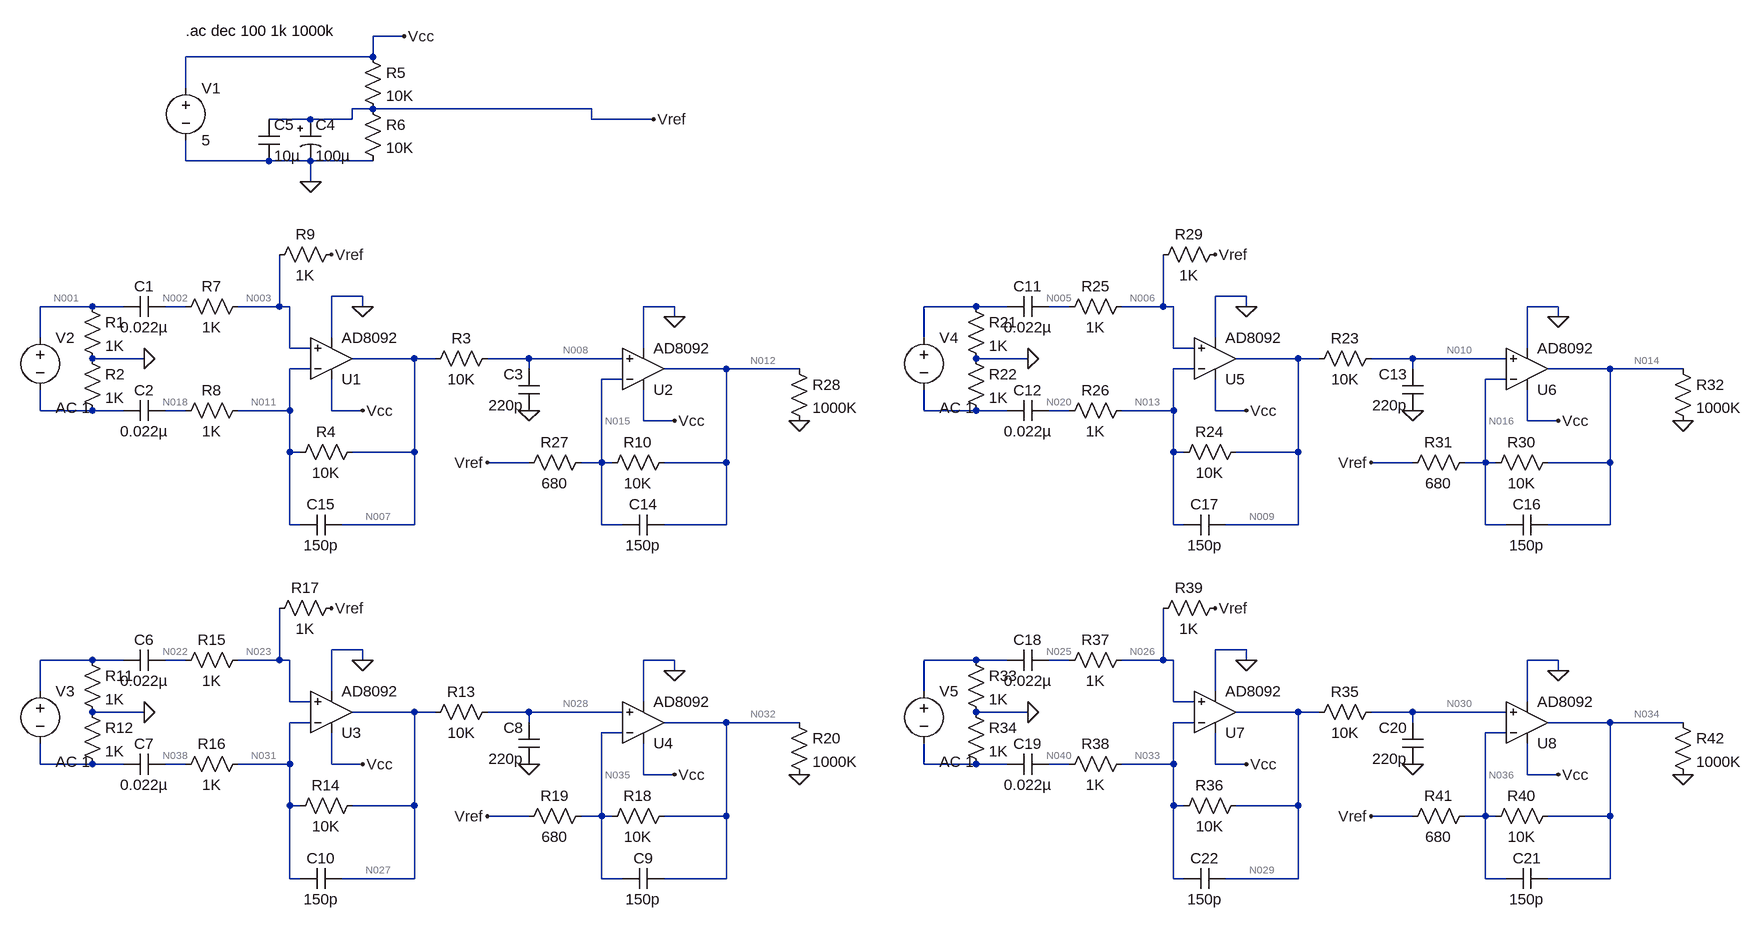
[diagram p0: schematic FilterGain.asc]
FilterGain.asc, the LTspice schematic file:
Version 4
SHEET 1 2400 928
WIRE 144 -432 96 -432
WIRE 96 -400 96 -432
WIRE 96 -400 -192 -400
WIRE -192 -352 -192 -400
WIRE 96 -320 64 -320
WIRE 432 -320 96 -320
WIRE 0 -304 -64 -304
WIRE 64 -304 64 -320
WIRE 64 -304 0 -304
WIRE 432 -304 432 -320
WIRE 528 -304 432 -304
WIRE -192 -240 -192 -272
WIRE -64 -240 -192 -240
WIRE 0 -240 -64 -240
WIRE 96 -240 0 -240
WIRE 0 -208 0 -240
WIRE 80 -32 32 -32
WIRE 1440 -32 1392 -32
WIRE -336 -16 -416 -16
WIRE -288 -16 -336 -16
WIRE -192 -16 -224 -16
WIRE -48 -16 -48 -96
WIRE -48 -16 -112 -16
WIRE -32 -16 -48 -16
WIRE 80 -16 80 -32
WIRE 560 -16 512 -16
WIRE 1024 -16 944 -16
WIRE 1072 -16 1024 -16
WIRE 1168 -16 1136 -16
WIRE 1312 -16 1312 -96
WIRE 1312 -16 1248 -16
WIRE 1328 -16 1312 -16
WIRE 1440 -16 1440 -32
WIRE 1920 -16 1872 -16
WIRE 560 0 560 -16
WIRE 1920 0 1920 -16
WIRE -416 32 -416 -16
WIRE 32 32 32 -32
WIRE 944 32 944 -16
WIRE 1392 32 1392 -32
WIRE -32 48 -32 -16
WIRE 0 48 -32 48
WIRE 512 48 512 -16
WIRE 1328 48 1328 -16
WIRE 1360 48 1328 48
WIRE 1872 48 1872 -16
WIRE -256 64 -336 64
WIRE 160 64 64 64
WIRE 192 64 160 64
WIRE 336 64 272 64
WIRE 480 64 336 64
WIRE 1104 64 1024 64
WIRE 1520 64 1424 64
WIRE 1552 64 1520 64
WIRE 1696 64 1632 64
WIRE 1840 64 1696 64
WIRE 0 80 -32 80
WIRE 336 80 336 64
WIRE 640 80 544 80
WIRE 752 80 640 80
WIRE 1360 80 1328 80
WIRE 1696 80 1696 64
WIRE 2000 80 1904 80
WIRE 2112 80 2000 80
WIRE 480 96 448 96
WIRE 1840 96 1808 96
WIRE -416 144 -416 112
WIRE -336 144 -416 144
WIRE -288 144 -336 144
WIRE -192 144 -224 144
WIRE -32 144 -32 80
WIRE -32 144 -112 144
WIRE 32 144 32 96
WIRE 80 144 32 144
WIRE 944 144 944 112
WIRE 1024 144 944 144
WIRE 1072 144 1024 144
WIRE 1168 144 1136 144
WIRE 1328 144 1328 80
WIRE 1328 144 1248 144
WIRE 1392 144 1392 96
WIRE 1440 144 1392 144
WIRE 512 160 512 112
WIRE 560 160 512 160
WIRE 1872 160 1872 112
WIRE 1920 160 1872 160
WIRE -32 208 -32 144
WIRE -16 208 -32 208
WIRE 160 208 160 64
WIRE 160 208 64 208
WIRE 1328 208 1328 144
WIRE 1344 208 1328 208
WIRE 1520 208 1520 64
WIRE 1520 208 1424 208
WIRE 336 224 272 224
WIRE 448 224 448 96
WIRE 448 224 416 224
WIRE 464 224 448 224
WIRE 640 224 640 80
WIRE 640 224 544 224
WIRE 1696 224 1632 224
WIRE 1808 224 1808 96
WIRE 1808 224 1776 224
WIRE 1824 224 1808 224
WIRE 2000 224 2000 80
WIRE 2000 224 1904 224
WIRE -32 320 -32 208
WIRE -16 320 -32 320
WIRE 160 320 160 208
WIRE 160 320 48 320
WIRE 448 320 448 224
WIRE 480 320 448 320
WIRE 640 320 640 224
WIRE 640 320 544 320
WIRE 1328 320 1328 208
WIRE 1344 320 1328 320
WIRE 1520 320 1520 208
WIRE 1520 320 1408 320
WIRE 1808 320 1808 224
WIRE 1840 320 1808 320
WIRE 2000 320 2000 224
WIRE 2000 320 1904 320
WIRE 80 512 32 512
WIRE 1440 512 1392 512
WIRE -336 528 -416 528
WIRE -288 528 -336 528
WIRE -192 528 -224 528
WIRE -48 528 -48 448
WIRE -48 528 -112 528
WIRE -32 528 -48 528
WIRE 80 528 80 512
WIRE 560 528 512 528
WIRE 1024 528 944 528
WIRE 1072 528 1024 528
WIRE 1168 528 1136 528
WIRE 1312 528 1312 448
WIRE 1312 528 1248 528
WIRE 1328 528 1312 528
WIRE 1440 528 1440 512
WIRE 1920 528 1872 528
WIRE 560 544 560 528
WIRE 1920 544 1920 528
WIRE -416 576 -416 528
WIRE 32 576 32 512
WIRE 944 576 944 528
WIRE 1392 576 1392 512
WIRE -32 592 -32 528
WIRE 0 592 -32 592
WIRE 512 592 512 528
WIRE 1328 592 1328 528
WIRE 1360 592 1328 592
WIRE 1872 592 1872 528
WIRE -256 608 -336 608
WIRE 160 608 64 608
WIRE 192 608 160 608
WIRE 336 608 272 608
WIRE 480 608 336 608
WIRE 1104 608 1024 608
WIRE 1520 608 1424 608
WIRE 1552 608 1520 608
WIRE 1696 608 1632 608
WIRE 1840 608 1696 608
WIRE 0 624 -32 624
WIRE 336 624 336 608
WIRE 640 624 544 624
WIRE 752 624 640 624
WIRE 1360 624 1328 624
WIRE 1696 624 1696 608
WIRE 2000 624 1904 624
WIRE 2112 624 2000 624
WIRE 480 640 448 640
WIRE 1840 640 1808 640
WIRE -416 688 -416 656
WIRE -336 688 -416 688
WIRE -288 688 -336 688
WIRE -192 688 -224 688
WIRE -32 688 -32 624
WIRE -32 688 -112 688
WIRE 32 688 32 640
WIRE 80 688 32 688
WIRE 944 688 944 656
WIRE 1024 688 944 688
WIRE 1072 688 1024 688
WIRE 1168 688 1136 688
WIRE 1328 688 1328 624
WIRE 1328 688 1248 688
WIRE 1392 688 1392 640
WIRE 1440 688 1392 688
WIRE 512 704 512 656
WIRE 560 704 512 704
WIRE 1872 704 1872 656
WIRE 1920 704 1872 704
WIRE -32 752 -32 688
WIRE -16 752 -32 752
WIRE 160 752 160 608
WIRE 160 752 64 752
WIRE 1328 752 1328 688
WIRE 1344 752 1328 752
WIRE 1520 752 1520 608
WIRE 1520 752 1424 752
WIRE 336 768 272 768
WIRE 448 768 448 640
WIRE 448 768 416 768
WIRE 464 768 448 768
WIRE 640 768 640 624
WIRE 640 768 544 768
WIRE 1696 768 1632 768
WIRE 1808 768 1808 640
WIRE 1808 768 1776 768
WIRE 1824 768 1808 768
WIRE 2000 768 2000 624
WIRE 2000 768 1904 768
WIRE -32 864 -32 752
WIRE -16 864 -32 864
WIRE 160 864 160 752
WIRE 160 864 48 864
WIRE 448 864 448 768
WIRE 480 864 448 864
WIRE 640 864 640 768
WIRE 640 864 544 864
WIRE 1328 864 1328 752
WIRE 1344 864 1328 864
WIRE 1520 864 1520 752
WIRE 1520 864 1408 864
WIRE 1808 864 1808 768
WIRE 1840 864 1808 864
WIRE 2000 864 2000 768
WIRE 2000 864 1904 864
FLAG 0 -208 0
FLAG 144 -432 Vcc
FLAG 528 -304 Vref
FLAG -256 64 0
FLAG 80 -16 0
FLAG 80 144 Vcc
FLAG 32 -96 Vref
FLAG 560 0 0
FLAG 560 160 Vcc
FLAG 752 160 0
FLAG 272 224 Vref
FLAG 336 144 0
FLAG -256 608 0
FLAG 80 528 0
FLAG 80 688 Vcc
FLAG 32 448 Vref
FLAG 560 544 0
FLAG 560 704 Vcc
FLAG 752 704 0
FLAG 272 768 Vref
FLAG 336 688 0
FLAG 1104 64 0
FLAG 1440 -16 0
FLAG 1440 144 Vcc
FLAG 1392 -96 Vref
FLAG 1920 0 0
FLAG 1920 160 Vcc
FLAG 2112 160 0
FLAG 1632 224 Vref
FLAG 1696 144 0
FLAG 1104 608 0
FLAG 1440 528 0
FLAG 1440 688 Vcc
FLAG 1392 448 Vref
FLAG 1920 544 0
FLAG 1920 704 Vcc
FLAG 2112 704 0
FLAG 1632 768 Vref
FLAG 1696 688 0
SYMBOL polcap -16 -304 R0
WINDOW 3 24 56 Left 2
SYMATTR Value 100µ
SYMATTR InstName C4
SYMATTR Description Capacitor
SYMATTR Type cap
SYMATTR SpiceLine V=6.3 Irms=150m Rser=0.85 Lser=0 mfg="Nichicon" pn="UPL0J101MAH" type="Al electrolytic"
SYMBOL cap -80 -304 R0
SYMATTR InstName C5
SYMATTR Value 10µ
SYMATTR SpiceLine V=25 Irms=8.06 Rser=0.00577565 Lser=0 mfg="KEMET" pn="C1210C106K3PAC" type="X5R"
SYMBOL res 80 -416 R0
SYMATTR InstName R5
SYMATTR Value 10K
SYMATTR SpiceLine tol=1 pwr=0.1
SYMBOL res 80 -336 R0
SYMATTR InstName R6
SYMATTR Value 10K
SYMATTR SpiceLine tol=1 pwr=0.1
SYMBOL voltage -192 -368 R0
WINDOW 123 0 0 Left 2
WINDOW 39 0 0 Left 2
SYMATTR InstName V1
SYMATTR Value 5
SYMBOL res -352 -32 R0
SYMATTR InstName R1
SYMATTR Value 1K
SYMATTR SpiceLine tol=1 pwr=0.1
SYMBOL res -352 48 R0
SYMATTR InstName R2
SYMATTR Value 1K
SYMATTR SpiceLine tol=1 pwr=0.1
SYMBOL cap -224 -32 R90
WINDOW 0 0 32 VBottom 2
WINDOW 3 32 32 VTop 2
SYMATTR InstName C1
SYMATTR Value 0.022µ
SYMATTR SpiceLine V=16 Irms=21.8m Rser=9.56706 Lser=0
SYMBOL cap -224 128 R90
WINDOW 0 0 32 VBottom 2
WINDOW 3 32 32 VTop 2
SYMATTR InstName C2
SYMATTR Value 0.022µ
SYMATTR SpiceLine V=16 Irms=21.8m Rser=9.56706 Lser=0
SYMBOL res 288 48 R90
WINDOW 0 0 56 VBottom 2
WINDOW 3 32 56 VTop 2
SYMATTR InstName R3
SYMATTR Value 10K
SYMATTR SpiceLine tol=1 pwr=0.1
SYMBOL res 80 192 R90
WINDOW 0 0 56 VBottom 2
WINDOW 3 32 56 VTop 2
SYMATTR InstName R4
SYMATTR Value 10K
SYMATTR SpiceLine tol=1 pwr=0.1
SYMBOL voltage -416 16 R0
WINDOW 123 24 124 Left 2
WINDOW 39 0 0 Left 2
SYMATTR Value2 AC 1
SYMATTR InstName V2
SYMATTR Value ""
SYMBOL res -96 -32 R90
WINDOW 0 0 56 VBottom 2
WINDOW 3 32 56 VTop 2
SYMATTR InstName R7
SYMATTR Value 1K
SYMATTR SpiceLine tol=1 pwr=0.1
SYMBOL res -96 128 R90
WINDOW 0 0 56 VBottom 2
WINDOW 3 32 56 VTop 2
SYMATTR InstName R8
SYMATTR Value 1K
SYMATTR SpiceLine tol=1 pwr=0.1
SYMBOL res 48 -112 R90
WINDOW 0 0 56 VBottom 2
WINDOW 3 32 56 VTop 2
SYMATTR InstName R9
SYMATTR Value 1K
SYMATTR SpiceLine tol=1 pwr=0.1
SYMBOL res 560 208 R90
WINDOW 0 0 56 VBottom 2
WINDOW 3 32 56 VTop 2
SYMATTR InstName R10
SYMATTR Value 10K
SYMATTR SpiceLine tol=1 pwr=0.1
SYMBOL res 432 208 R90
WINDOW 0 0 56 VBottom 2
WINDOW 3 32 56 VTop 2
SYMATTR InstName R27
SYMATTR Value 680
SYMATTR SpiceLine tol=1 pwr=0.1
SYMBOL res 736 64 R0
SYMATTR InstName R28
SYMATTR Value 1000K
SYMBOL Opamps\\AD8092 32 128 M180
SYMATTR InstName U1
SYMBOL Opamps\\AD8092 512 144 M180
SYMATTR InstName U2
SYMBOL cap 352 144 R180
WINDOW 0 24 56 Left 2
WINDOW 3 24 8 Left 2
SYMATTR InstName C3
SYMATTR Value 220p
SYMATTR SpiceLine V=16 Irms=459m Rser=0.256209 Lser=0
SYMBOL cap 480 336 R270
WINDOW 0 32 32 VTop 2
WINDOW 3 0 32 VBottom 2
SYMATTR InstName C14
SYMATTR Value 150p
SYMATTR SpiceLine V=16 Irms=459m Rser=0.256209 Lser=0
SYMBOL cap -16 336 R270
WINDOW 0 32 32 VTop 2
WINDOW 3 0 32 VBottom 2
SYMATTR InstName C15
SYMATTR Value 150p
SYMATTR SpiceLine V=16 Irms=459m Rser=0.256209 Lser=0
SYMBOL res -352 512 R0
SYMATTR InstName R11
SYMATTR Value 1K
SYMATTR SpiceLine tol=1 pwr=0.1
SYMBOL res -352 592 R0
SYMATTR InstName R12
SYMATTR Value 1K
SYMATTR SpiceLine tol=1 pwr=0.1
SYMBOL cap -224 512 R90
WINDOW 0 0 32 VBottom 2
WINDOW 3 32 32 VTop 2
SYMATTR InstName C6
SYMATTR Value 0.022µ
SYMATTR SpiceLine V=16 Irms=21.8m Rser=9.56706 Lser=0
SYMBOL cap -224 672 R90
WINDOW 0 0 32 VBottom 2
WINDOW 3 32 32 VTop 2
SYMATTR InstName C7
SYMATTR Value 0.022µ
SYMATTR SpiceLine V=16 Irms=21.8m Rser=9.56706 Lser=0
SYMBOL res 288 592 R90
WINDOW 0 0 56 VBottom 2
WINDOW 3 32 56 VTop 2
SYMATTR InstName R13
SYMATTR Value 10K
SYMATTR SpiceLine tol=1 pwr=0.1
SYMBOL res 80 736 R90
WINDOW 0 0 56 VBottom 2
WINDOW 3 32 56 VTop 2
SYMATTR InstName R14
SYMATTR Value 10K
SYMATTR SpiceLine tol=1 pwr=0.1
SYMBOL voltage -416 560 R0
WINDOW 123 24 124 Left 2
WINDOW 39 0 0 Left 2
SYMATTR Value2 AC 1
SYMATTR InstName V3
SYMATTR Value ""
SYMBOL res -96 512 R90
WINDOW 0 0 56 VBottom 2
WINDOW 3 32 56 VTop 2
SYMATTR InstName R15
SYMATTR Value 1K
SYMATTR SpiceLine tol=1 pwr=0.1
SYMBOL res -96 672 R90
WINDOW 0 0 56 VBottom 2
WINDOW 3 32 56 VTop 2
SYMATTR InstName R16
SYMATTR Value 1K
SYMATTR SpiceLine tol=1 pwr=0.1
SYMBOL res 48 432 R90
WINDOW 0 0 56 VBottom 2
WINDOW 3 32 56 VTop 2
SYMATTR InstName R17
SYMATTR Value 1K
SYMATTR SpiceLine tol=1 pwr=0.1
SYMBOL res 560 752 R90
WINDOW 0 0 56 VBottom 2
WINDOW 3 32 56 VTop 2
SYMATTR InstName R18
SYMATTR Value 10K
SYMATTR SpiceLine tol=1 pwr=0.1
SYMBOL res 432 752 R90
WINDOW 0 0 56 VBottom 2
WINDOW 3 32 56 VTop 2
SYMATTR InstName R19
SYMATTR Value 680
SYMATTR SpiceLine tol=1 pwr=0.1
SYMBOL res 736 608 R0
SYMATTR InstName R20
SYMATTR Value 1000K
SYMBOL Opamps\\AD8092 32 672 M180
SYMATTR InstName U3
SYMBOL Opamps\\AD8092 512 688 M180
SYMATTR InstName U4
SYMBOL cap 352 688 R180
WINDOW 0 24 56 Left 2
WINDOW 3 24 8 Left 2
SYMATTR InstName C8
SYMATTR Value 220p
SYMATTR SpiceLine V=16 Irms=459m Rser=0.256209 Lser=0
SYMBOL cap 480 880 R270
WINDOW 0 32 32 VTop 2
WINDOW 3 0 32 VBottom 2
SYMATTR InstName C9
SYMATTR Value 150p
SYMATTR SpiceLine V=16 Irms=459m Rser=0.256209 Lser=0
SYMBOL cap -16 880 R270
WINDOW 0 32 32 VTop 2
WINDOW 3 0 32 VBottom 2
SYMATTR InstName C10
SYMATTR Value 150p
SYMATTR SpiceLine V=16 Irms=459m Rser=0.256209 Lser=0
SYMBOL res 1008 -32 R0
SYMATTR InstName R21
SYMATTR Value 1K
SYMATTR SpiceLine tol=1 pwr=0.1
SYMBOL res 1008 48 R0
SYMATTR InstName R22
SYMATTR Value 1K
SYMATTR SpiceLine tol=1 pwr=0.1
SYMBOL cap 1136 -32 R90
WINDOW 0 0 32 VBottom 2
WINDOW 3 32 32 VTop 2
SYMATTR InstName C11
SYMATTR Value 0.022µ
SYMATTR SpiceLine V=16 Irms=21.8m Rser=9.56706 Lser=0
SYMBOL cap 1136 128 R90
WINDOW 0 0 32 VBottom 2
WINDOW 3 32 32 VTop 2
SYMATTR InstName C12
SYMATTR Value 0.022µ
SYMATTR SpiceLine V=16 Irms=21.8m Rser=9.56706 Lser=0
SYMBOL res 1648 48 R90
WINDOW 0 0 56 VBottom 2
WINDOW 3 32 56 VTop 2
SYMATTR InstName R23
SYMATTR Value 10K
SYMATTR SpiceLine tol=1 pwr=0.1
SYMBOL res 1440 192 R90
WINDOW 0 0 56 VBottom 2
WINDOW 3 32 56 VTop 2
SYMATTR InstName R24
SYMATTR Value 10K
SYMATTR SpiceLine tol=1 pwr=0.1
SYMBOL voltage 944 16 R0
WINDOW 123 24 124 Left 2
WINDOW 39 0 0 Left 2
SYMATTR Value2 AC 1
SYMATTR InstName V4
SYMATTR Value ""
SYMBOL res 1264 -32 R90
WINDOW 0 0 56 VBottom 2
WINDOW 3 32 56 VTop 2
SYMATTR InstName R25
SYMATTR Value 1K
SYMATTR SpiceLine tol=1 pwr=0.1
SYMBOL res 1264 128 R90
WINDOW 0 0 56 VBottom 2
WINDOW 3 32 56 VTop 2
SYMATTR InstName R26
SYMATTR Value 1K
SYMATTR SpiceLine tol=1 pwr=0.1
SYMBOL res 1408 -112 R90
WINDOW 0 0 56 VBottom 2
WINDOW 3 32 56 VTop 2
SYMATTR InstName R29
SYMATTR Value 1K
SYMATTR SpiceLine tol=1 pwr=0.1
SYMBOL res 1920 208 R90
WINDOW 0 0 56 VBottom 2
WINDOW 3 32 56 VTop 2
SYMATTR InstName R30
SYMATTR Value 10K
SYMATTR SpiceLine tol=1 pwr=0.1
SYMBOL res 1792 208 R90
WINDOW 0 0 56 VBottom 2
WINDOW 3 32 56 VTop 2
SYMATTR InstName R31
SYMATTR Value 680
SYMATTR SpiceLine tol=1 pwr=0.1
SYMBOL res 2096 64 R0
SYMATTR InstName R32
SYMATTR Value 1000K
SYMBOL Opamps\\AD8092 1392 128 M180
SYMATTR InstName U5
SYMBOL Opamps\\AD8092 1872 144 M180
SYMATTR InstName U6
SYMBOL cap 1712 144 R180
WINDOW 0 24 56 Left 2
WINDOW 3 24 8 Left 2
SYMATTR InstName C13
SYMATTR Value 220p
SYMATTR SpiceLine V=16 Irms=459m Rser=0.256209 Lser=0
SYMBOL cap 1840 336 R270
WINDOW 0 32 32 VTop 2
WINDOW 3 0 32 VBottom 2
SYMATTR InstName C16
SYMATTR Value 150p
SYMATTR SpiceLine V=16 Irms=459m Rser=0.256209 Lser=0
SYMBOL cap 1344 336 R270
WINDOW 0 32 32 VTop 2
WINDOW 3 0 32 VBottom 2
SYMATTR InstName C17
SYMATTR Value 150p
SYMATTR SpiceLine V=16 Irms=459m Rser=0.256209 Lser=0
SYMBOL res 1008 512 R0
SYMATTR InstName R33
SYMATTR Value 1K
SYMATTR SpiceLine tol=1 pwr=0.1
SYMBOL res 1008 592 R0
SYMATTR InstName R34
SYMATTR Value 1K
SYMATTR SpiceLine tol=1 pwr=0.1
SYMBOL cap 1136 512 R90
WINDOW 0 0 32 VBottom 2
WINDOW 3 32 32 VTop 2
SYMATTR InstName C18
SYMATTR Value 0.022µ
SYMATTR SpiceLine V=16 Irms=21.8m Rser=9.56706 Lser=0
SYMBOL cap 1136 672 R90
WINDOW 0 0 32 VBottom 2
WINDOW 3 32 32 VTop 2
SYMATTR InstName C19
SYMATTR Value 0.022µ
SYMATTR SpiceLine V=16 Irms=21.8m Rser=9.56706 Lser=0
SYMBOL res 1648 592 R90
WINDOW 0 0 56 VBottom 2
WINDOW 3 32 56 VTop 2
SYMATTR InstName R35
SYMATTR Value 10K
SYMATTR SpiceLine tol=1 pwr=0.1
SYMBOL res 1440 736 R90
WINDOW 0 0 56 VBottom 2
WINDOW 3 32 56 VTop 2
SYMATTR InstName R36
SYMATTR Value 10K
SYMATTR SpiceLine tol=1 pwr=0.1
SYMBOL voltage 944 560 R0
WINDOW 123 24 124 Left 2
WINDOW 39 0 0 Left 2
SYMATTR Value2 AC 1
SYMATTR InstName V5
SYMATTR Value ""
SYMBOL res 1264 512 R90
WINDOW 0 0 56 VBottom 2
WINDOW 3 32 56 VTop 2
SYMATTR InstName R37
SYMATTR Value 1K
SYMATTR SpiceLine tol=1 pwr=0.1
SYMBOL res 1264 672 R90
WINDOW 0 0 56 VBottom 2
WINDOW 3 32 56 VTop 2
SYMATTR InstName R38
SYMATTR Value 1K
SYMATTR SpiceLine tol=1 pwr=0.1
SYMBOL res 1408 432 R90
WINDOW 0 0 56 VBottom 2
WINDOW 3 32 56 VTop 2
SYMATTR InstName R39
SYMATTR Value 1K
SYMATTR SpiceLine tol=1 pwr=0.1
SYMBOL res 1920 752 R90
WINDOW 0 0 56 VBottom 2
WINDOW 3 32 56 VTop 2
SYMATTR InstName R40
SYMATTR Value 10K
SYMATTR SpiceLine tol=1 pwr=0.1
SYMBOL res 1792 752 R90
WINDOW 0 0 56 VBottom 2
WINDOW 3 32 56 VTop 2
SYMATTR InstName R41
SYMATTR Value 680
SYMATTR SpiceLine tol=1 pwr=0.1
SYMBOL res 2096 608 R0
SYMATTR InstName R42
SYMATTR Value 1000K
SYMBOL Opamps\\AD8092 1392 672 M180
SYMATTR InstName U7
SYMBOL Opamps\\AD8092 1872 688 M180
SYMATTR InstName U8
SYMBOL cap 1712 688 R180
WINDOW 0 24 56 Left 2
WINDOW 3 24 8 Left 2
SYMATTR InstName C20
SYMATTR Value 220p
SYMATTR SpiceLine V=16 Irms=459m Rser=0.256209 Lser=0
SYMBOL cap 1840 880 R270
WINDOW 0 32 32 VTop 2
WINDOW 3 0 32 VBottom 2
SYMATTR InstName C21
SYMATTR Value 150p
SYMATTR SpiceLine V=16 Irms=459m Rser=0.256209 Lser=0
SYMBOL cap 1344 880 R270
WINDOW 0 32 32 VTop 2
WINDOW 3 0 32 VBottom 2
SYMATTR InstName C22
SYMATTR Value 150p
SYMATTR SpiceLine V=16 Irms=459m Rser=0.256209 Lser=0
TEXT -192 -440 Left 2 !.ac dec 100 1k 1000k

The netlist it stands for:
* FilterGain.asc
C4 Vref 0 100µ V=6.3 Irms=150m Rser=0.85 Lser=0 mfg="Nichicon" pn="UPL0J101MAH" type="Al electrolytic"
C5 Vref 0 10µ V=25 Irms=8.06 Rser=0.00577565 Lser=0 mfg="KEMET" pn="C1210C106K3PAC" type="X5R"
R5 Vcc Vref 10K tol=1 pwr=0.1
R6 Vref 0 10K tol=1 pwr=0.1
V1 Vcc 0 5
R1 N001 0 1K tol=1 pwr=0.1
R2 0 N017 1K tol=1 pwr=0.1
C1 N002 N001 0.022µ V=16 Irms=21.8m Rser=9.56706 Lser=0
C2 N018 N017 0.022µ V=16 Irms=21.8m Rser=9.56706 Lser=0
R3 N008 N007 10K tol=1 pwr=0.1
R4 N007 N011 10K tol=1 pwr=0.1
V2 N001 N017 AC 1
R7 N003 N002 1K tol=1 pwr=0.1
R8 N011 N018 1K tol=1 pwr=0.1
R9 Vref N003 1K tol=1 pwr=0.1
R10 N012 N015 10K tol=1 pwr=0.1
R27 N015 Vref 680 tol=1 pwr=0.1
R28 N012 0 1000K
XU1 N003 N011 Vcc 0 N007 AD8092  ; pins In+ In- V+ V- OUT
XU2 N008 N015 Vcc 0 N012 AD8092  ; pins In+ In- V+ V- OUT
C3 0 N008 220p V=16 Irms=459m Rser=0.256209 Lser=0
C14 N015 N012 150p V=16 Irms=459m Rser=0.256209 Lser=0
C15 N011 N007 150p V=16 Irms=459m Rser=0.256209 Lser=0
R11 N021 0 1K tol=1 pwr=0.1
R12 0 N037 1K tol=1 pwr=0.1
C6 N022 N021 0.022µ V=16 Irms=21.8m Rser=9.56706 Lser=0
C7 N038 N037 0.022µ V=16 Irms=21.8m Rser=9.56706 Lser=0
R13 N028 N027 10K tol=1 pwr=0.1
R14 N027 N031 10K tol=1 pwr=0.1
V3 N021 N037 AC 1
R15 N023 N022 1K tol=1 pwr=0.1
R16 N031 N038 1K tol=1 pwr=0.1
R17 Vref N023 1K tol=1 pwr=0.1
R18 N032 N035 10K tol=1 pwr=0.1
R19 N035 Vref 680 tol=1 pwr=0.1
R20 N032 0 1000K
XU3 N023 N031 Vcc 0 N027 AD8092  ; pins In+ In- V+ V- OUT
XU4 N028 N035 Vcc 0 N032 AD8092  ; pins In+ In- V+ V- OUT
C8 0 N028 220p V=16 Irms=459m Rser=0.256209 Lser=0
C9 N035 N032 150p V=16 Irms=459m Rser=0.256209 Lser=0
C10 N031 N027 150p V=16 Irms=459m Rser=0.256209 Lser=0
R21 N004 0 1K tol=1 pwr=0.1
R22 0 N019 1K tol=1 pwr=0.1
C11 N005 N004 0.022µ V=16 Irms=21.8m Rser=9.56706 Lser=0
C12 N020 N019 0.022µ V=16 Irms=21.8m Rser=9.56706 Lser=0
R23 N010 N009 10K tol=1 pwr=0.1
R24 N009 N013 10K tol=1 pwr=0.1
V4 N004 N019 AC 1
R25 N006 N005 1K tol=1 pwr=0.1
R26 N013 N020 1K tol=1 pwr=0.1
R29 Vref N006 1K tol=1 pwr=0.1
R30 N014 N016 10K tol=1 pwr=0.1
R31 N016 Vref 680 tol=1 pwr=0.1
R32 N014 0 1000K
XU5 N006 N013 Vcc 0 N009 AD8092  ; pins In+ In- V+ V- OUT
XU6 N010 N016 Vcc 0 N014 AD8092  ; pins In+ In- V+ V- OUT
C13 0 N010 220p V=16 Irms=459m Rser=0.256209 Lser=0
C16 N016 N014 150p V=16 Irms=459m Rser=0.256209 Lser=0
C17 N013 N009 150p V=16 Irms=459m Rser=0.256209 Lser=0
R33 N024 0 1K tol=1 pwr=0.1
R34 0 N039 1K tol=1 pwr=0.1
C18 N025 N024 0.022µ V=16 Irms=21.8m Rser=9.56706 Lser=0
C19 N040 N039 0.022µ V=16 Irms=21.8m Rser=9.56706 Lser=0
R35 N030 N029 10K tol=1 pwr=0.1
R36 N029 N033 10K tol=1 pwr=0.1
V5 N024 N039 AC 1
R37 N026 N025 1K tol=1 pwr=0.1
R38 N033 N040 1K tol=1 pwr=0.1
R39 Vref N026 1K tol=1 pwr=0.1
R40 N034 N036 10K tol=1 pwr=0.1
R41 N036 Vref 680 tol=1 pwr=0.1
R42 N034 0 1000K
XU7 N026 N033 Vcc 0 N029 AD8092  ; pins In+ In- V+ V- OUT
XU8 N030 N036 Vcc 0 N034 AD8092  ; pins In+ In- V+ V- OUT
C20 0 N030 220p V=16 Irms=459m Rser=0.256209 Lser=0
C21 N036 N034 150p V=16 Irms=459m Rser=0.256209 Lser=0
C22 N033 N029 150p V=16 Irms=459m Rser=0.256209 Lser=0
.ac dec 100 1k 1000k
.backanno
.end

* Results of the author's LTspice run, read from the files saved beside the schematic
* Operating Point, zero values left out:
*   V(vref) = 2.565 V
*   V(vcc) = 5 V
*   V(n002) = 2.565 V
*   V(n018) = 2.567 V
*   V(n008) = 2.565 V
*   V(n007) = 2.562 V
*   V(n011) = 2.567 V
*   V(n003) = 2.565 V
*   V(n012) = 2.592 V
*   V(n015) = 2.567 V
*   V(n022) = 2.565 V
*   V(n038) = 2.567 V
*   V(n028) = 2.565 V
*   V(n027) = 2.562 V
*   V(n031) = 2.567 V
*   V(n023) = 2.565 V
*   V(n032) = 2.592 V
*   V(n035) = 2.567 V
*   V(n005) = 2.565 V
*   V(n020) = 2.567 V
*   V(n010) = 2.565 V
*   V(n009) = 2.562 V
*   V(n013) = 2.567 V
*   V(n006) = 2.565 V
*   V(n014) = 2.592 V
*   V(n016) = 2.567 V
*   V(n025) = 2.565 V
*   V(n040) = 2.567 V
*   V(n030) = 2.565 V
*   V(n029) = 2.562 V
*   V(n033) = 2.567 V
*   V(n026) = 2.565 V
*   V(n034) = 2.592 V
*   V(n036) = 2.567 V
*   I(R42) = 2.592 µA
*   I(R41) = 2.974 µA
*   I(R40) = 2.501 µA
*   I(R39) = -273.2 nA
*   I(R36) = -473.2 nA
*   I(R35) = 273.2 nA
*   I(R32) = 2.592 µA
*   I(R31) = 2.974 µA
*   I(R30) = 2.501 µA
*   I(R29) = -273.2 nA
*   I(R24) = -473.2 nA
*   I(R23) = 273.2 nA
*   I(R20) = 2.592 µA
*   I(R19) = 2.974 µA
*   I(R18) = 2.501 µA
*   I(R17) = -273.2 nA
*   I(R14) = -473.2 nA
*   I(R13) = 273.2 nA
*   I(R28) = 2.592 µA
*   I(R27) = 2.974 µA
*   I(R10) = 2.501 µA
*   I(R9) = -273.2 nA
*   I(R4) = -473.2 nA
*   I(R3) = 273.2 nA
*   I(R6) = 256.5 µA
*   I(R5) = 243.5 µA
*   I(V1) = -12.43 mA
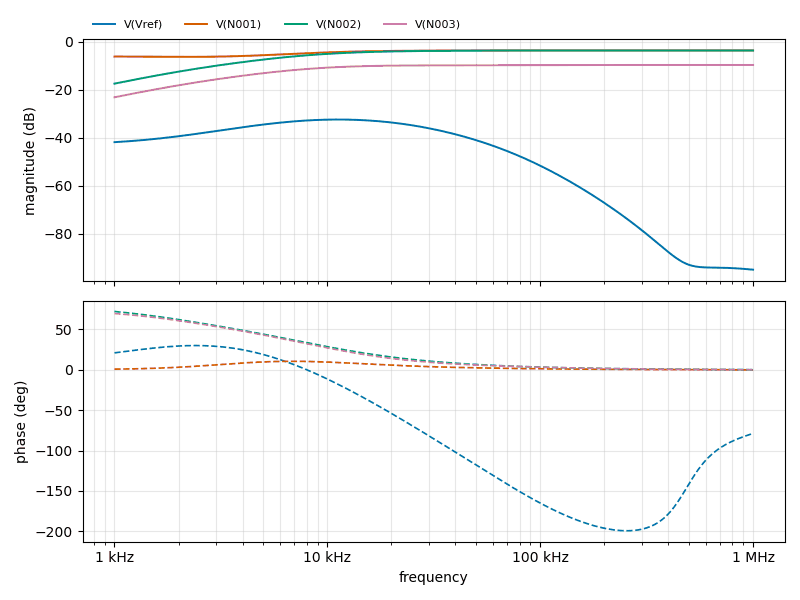
[diagram p1: AC Analysis of FilterGain.asc, plotted from the saved traces]
* AC Analysis, 1 run:
*   V(Vref): -41.85 dB at 1 kHz, -95.01 dB at 1 MHz, peak -32.41 dB at 11.22 kHz, 3 dB below the peak at 4.162 kHz and 27.46 kHz
*   V(N001): -6.15 dB at 1 kHz, -3.60 dB at 1 MHz, peak -3.59 dB at 144.5 kHz
*   V(N002): -17.45 dB at 1 kHz, -3.64 dB at 1 MHz, peak -3.64 dB at 166 kHz, 3 dB below the peak at 6 kHz
*   V(N003): -23.14 dB at 1 kHz, -9.66 dB at 1 MHz, peak -9.66 dB at 295.1 kHz, 3 dB below the peak at 5.513 kHz